# Altium schematic sheet AuxHalfH.SchDoc
size A3; DocumentNumber: 5; SheetNumber: 5; SheetTotal: 5
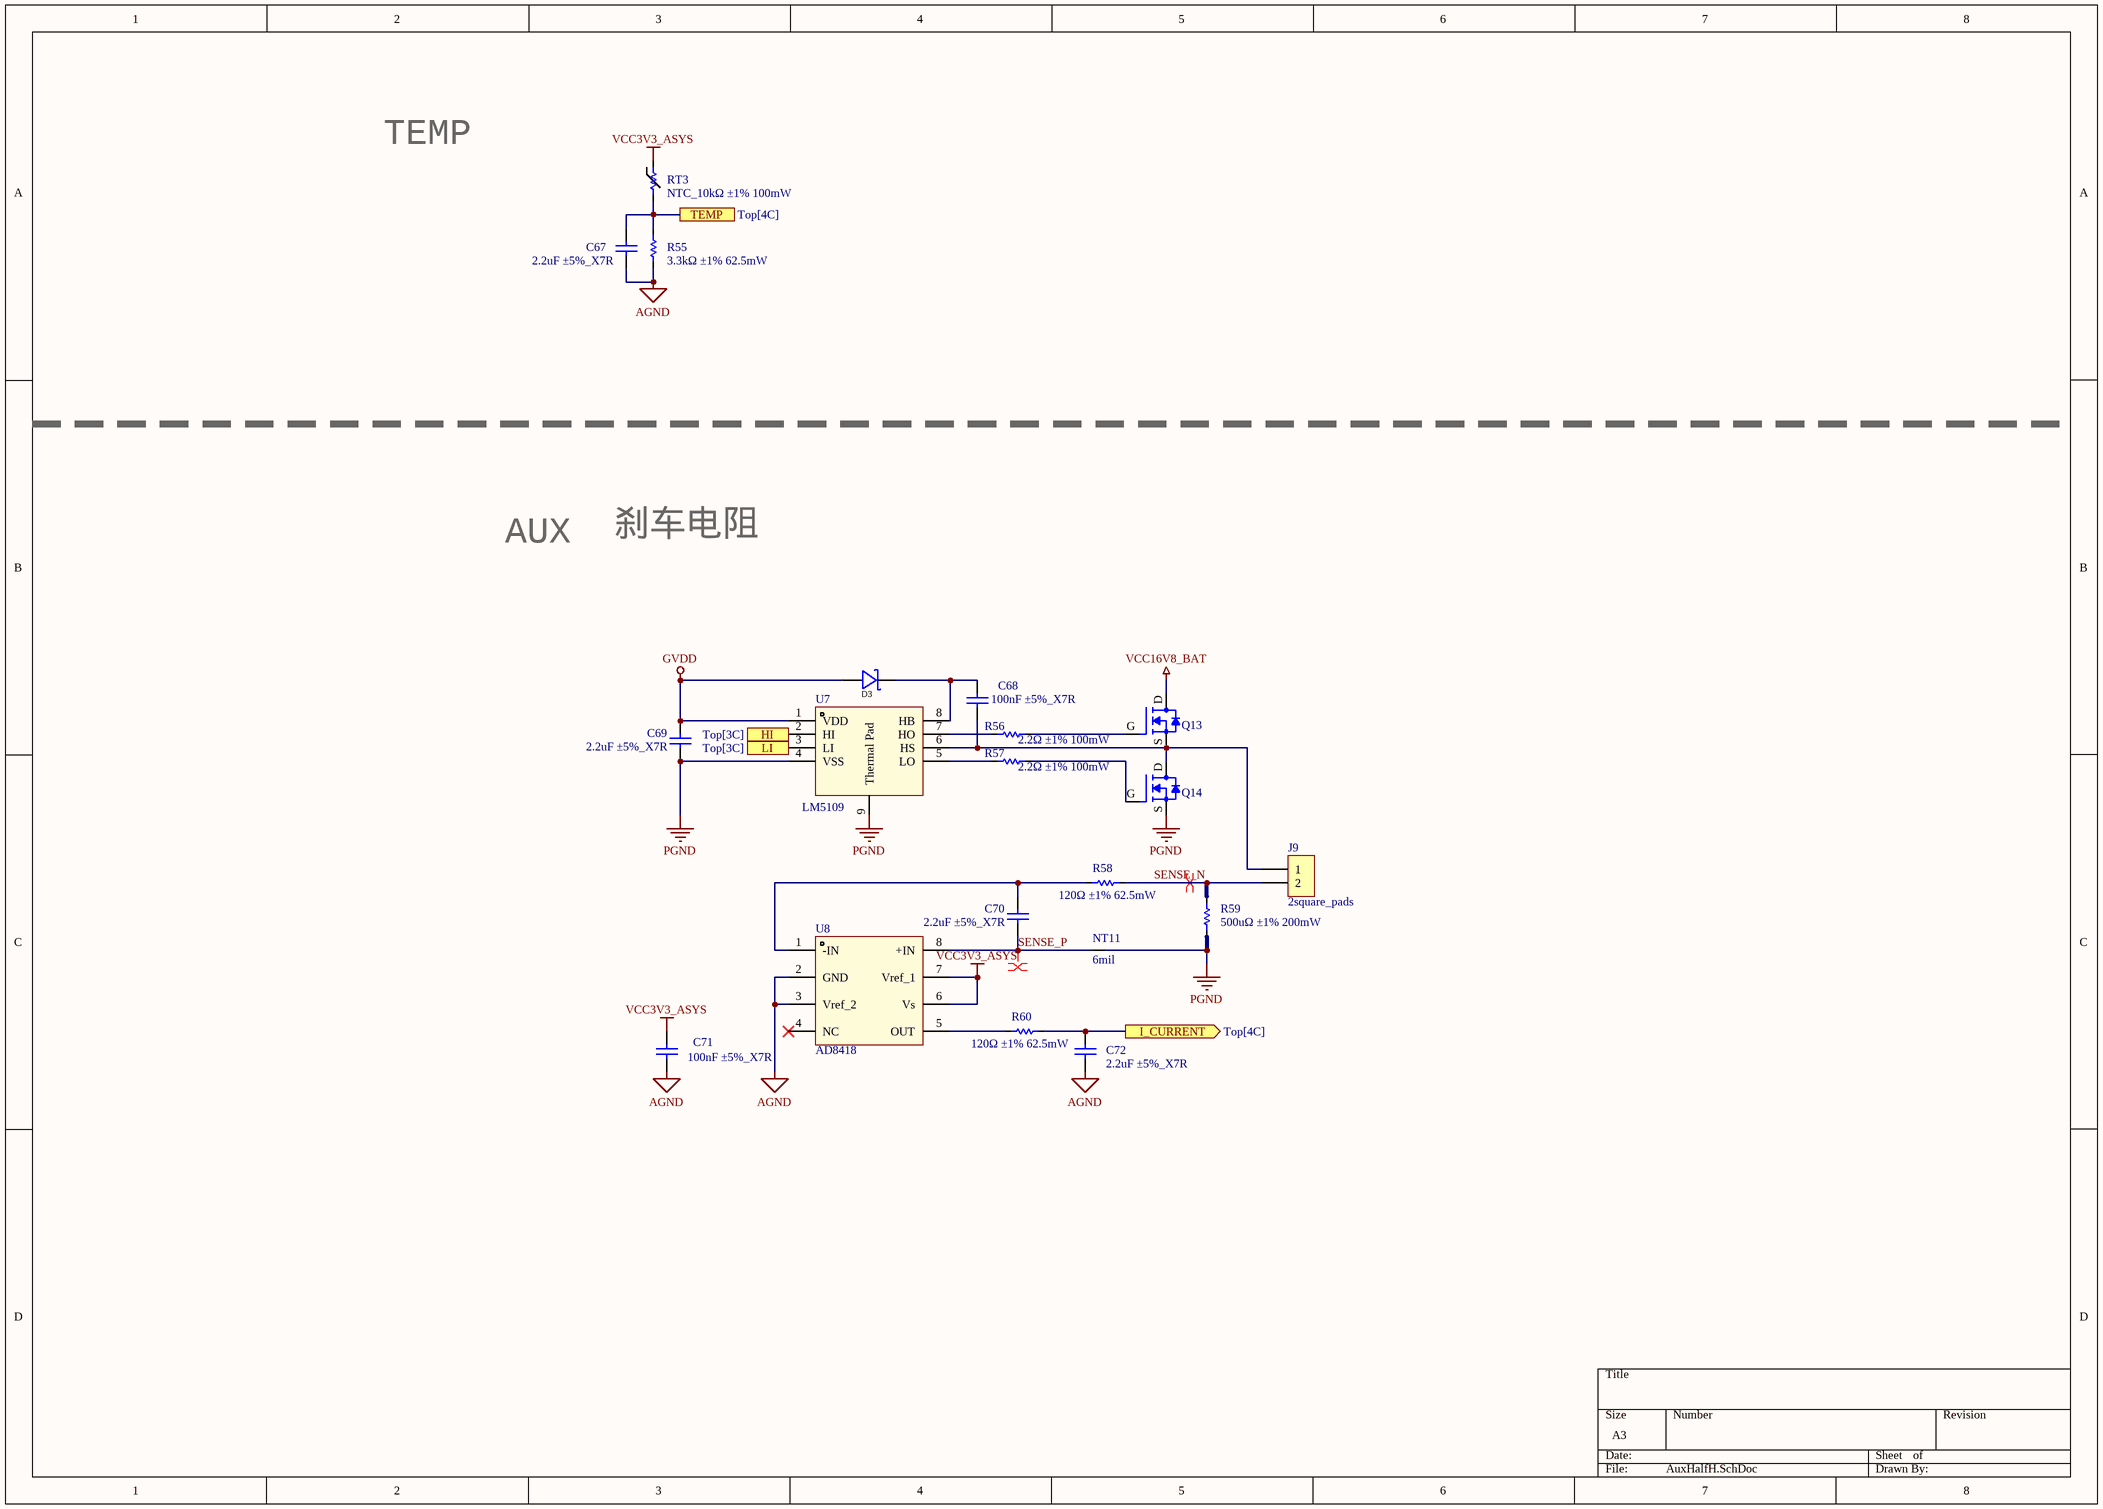
[diagram p0: AuxHalfH.SchDoc]

## Parts
C67  2.2uF ±5%_X7R  [WCAP-CSGP_0402_L1W0.5H0.5]
C68  100nF ±5%_X7R  [WCAP-CSGP_0603_L1.6W0.8H0.8_Reflow]
C69  2.2uF ±5%_X7R  [WCAP-CSGP_0603_L1.6W0.8H0.8_Reflow]
C70  2.2uF ±5%_X7R  [WCAP-CSGP_0402_L1W0.5H0.5]
C71  100nF ±5%_X7R  [WCAP-CSGP_0402_L1W0.5H0.5]
C72  2.2uF ±5%_X7R  [WCAP-CSGP_0402_L1W0.5H0.5]
D3  B340A-13-F  [SMA_L4.4-W2.6-LS5.0-RD]  (value not drawn)
J9  2square_pads  [2pads_square]
NT11  6mil  [NETTIE_6mil]  (net tie, no BOM)
Q13  BSC027N04LSG  [NRVTS10100EMFST1G]  (value not drawn)
Q14  BSC027N04LSG  [NRVTS10100EMFST1G]  (value not drawn)
R55  3.3kΩ ±1% 62.5mW  [WRIS-KSKE_0402]
R56  2.2Ω ±1% 100mW  [WRIS-KSKE_0402]
R57  2.2Ω ±1% 100mW  [WRIS-KSKE_0402]
R58  120Ω ±1% 62.5mW  [WRIS-KSKE_0402]
R59  500uΩ ±1% 200mW  [WRIS-KSKE_2512]
R60  120Ω ±1% 62.5mW  [WRIS-KSKE_0402]
RT3  NTC_10kΩ ±1% 100mW  [WRIS-KSKE_0402]
U7  LM5109  [SON80P400X80_HS-9N]
U8  AD8418  [MSOP-8_L3.0-W3.0-P0.65-LS5.0-BL]

## Ports
HI (see Top[3C]), I_CURRENT (out, see Top[4C]), LI (see Top[3C]), TEMP (see Top[4C])

## Nets
AGND: C67.1 C71.1 C72.1 R55.1 U8.2(GND) U8.3(Vref_2)
GVDD: C69.2 D3.2(A) U7.1(VDD)
PGND: C69.1 NT11.1 Q14.S R59.2 U7.4(VSS) U7.9(Thermal_Pad)
VCC3V3_ASYS: C71.2 RT3.1 U8.6(Vs) U8.7(Vref_1)
VCC16V8_BAT: Q13.D
HI: U7.2(HI) ; port HI
I_CURRENT: C72.2 R60.1 ; port I_CURRENT
LI: U7.3(LI) ; port LI
SENSE_N: J9.2 R58.1 R59.1
SENSE_P: C70.1 NT11.2 U8.8(+IN)
TEMP: C67.2 R55.2 RT3.2 ; port TEMP
NetC68_1: C68.1 J9.1 Q13.S Q14.D U7.6(HS)
NetC68_2: C68.2 D3.1(K) U7.8(HB)
NetC70_2: C70.2 R58.2 U8.1(-IN)
NetQ13_G: Q13.G R56.1
NetQ14_G: Q14.G R57.1
NetR56_2: R56.2 U7.7(HO)
NetR57_2: R57.2 U7.5(LO)
NetR60_2: R60.2 U8.5(OUT)

Not connected (* = marked no-connect by the designer): U8 4(NC)*

## Layout directives
differential pair: SENSE_N, SENSE_P

## Notes on the sheet
- TEMP
- AUX
- 刹车电阻

## Library data of the parts
C67-C72 = Cap: Capacitor; Published: 8-Jun-2000; LatestRevisionDate: 17-Jul-2002; LatestRevisionNote: Re-released for DXP Platform.; PackageReference: RAD-0.3; Publisher: Altium Limited; PackageDescription: Radial Cap, Thru-Hole; 2 Leads; 0.3 in Pin Spacing
D3 = Diode_Schottky: 直流反向耐压(Vr):40V;平均整流电流(Io):3A;正向压降(Vf):500mV@3A;; Manufacturer: DIODES(美台); Add into BOM: yes; Reverse Voltage (Vr): 40V; Average Rectified Current (Io): 3A; Name: B340A-13-F; Symbol: B340A-13-F; Device: B340A-13-F; LCSC Part Name: 40V 3A 500mV@3A; Supplier Part: C85098; Manufacturer Part: B340A-13-F; Supplier Footprint: SMA(DO-214AC); JLCPCB Part Class: 扩展库; Datasheet: https://atta.szlcsc.com/upload/public/pdf/source/20171023/C134454_15087453575121052549.pdf; Supplier: LCSC; Convert to PCB: yes; Forward Voltage (Vf@If): 500mV@3A
NT11 = NETTIE
Q13 Q14 = MOSFET-N: MOSFET – Power, Single, / N-Channel, PG-TDSON-8 / SuperSO8 5x6 / 40 V, 139 A; Manufacturer: ON Semiconductor; Manufacturer Part Number: NTMFS4935NT1G; Drain to Source Voltage (Vdss): 30V; Current - Continuous Drain (Id) @ 25°C: 13A (Ta), 93A (Tc); Drive Voltage (Max Rds On,  Min Rds On): 4.5V, 10V; Vgs(th) (Max) @ Id: 2.2V @ 250µA; Gate Charge (Qg) (Max) @ Vgs: 49.4nC @ 10V; Input Capacitance (Ciss) (Max) @ Vds: 4850pF @ 15V; Vgs (Max): ±20V; Power Dissipation (Max): 930mW (Ta), 48W (Tc); Rds On (Max) @ Id, Vgs: 3.2 mOhm @ 30A, 10V; Supplier 1: Digi-Key; Supplier Part Number 1: NTMFS4935NT1GOSCT-ND; RoHS: RoHS Compliant; Category: Discrete Semiconductor Products; Stock 1: 932; Pricing 1: 1=0.61, 10=0.541, 100=0.4145, 500=0.3277 (USD); Packaging: Cut Tape (CT); Part Status: Active; FET Type: N-Channel; Technology: MOSFET (Metal Oxide); FET Feature: -; Operating Temperature: -55°C ~ 150°C (TJ); Mounting Type: Surface Mount; Supplier Device Package: 5-DFN (5x6) (8-SOFL); Package / Case: 8-PowerTDFN, 5 Leads; ComponentLink1URL: http://www.onsemi.com/pub_link/Collateral/NTMFS4935N-D.PDF; ComponentLink1Description: http://www.onsemi.com/pub_link/Collateral/NTMFS4935N-D.PDF
R55-R60 = Res: Resistor; Published: 8-Jun-2000; LatestRevisionDate: 17-Jul-2002; LatestRevisionNote: Re-released for DXP Platform.; PackageReference: AXIAL-0.3; Publisher: Altium Limited; PackageDescription: Axial Device, Thru-Hole; 2 Leads; 0.3 in Pin Spacing
RT3 = TEMP RES: THERMISTOR 10K OHM NTC 0402 SMD
U7 = LM5109: DRIVER, MOSFET, HALF BRIDGE, WSON-8, 1A; Supplier 1: Farnell; Supplier Part Number 1: 2400642RL; Supplier 2: Farnell; Supplier Part Number 2: 2400642; Supplier 3: Farnell; Supplier Part Number 3: 2382850
U8 = AD8418WBRZ: ANALOG DEVICES Current Sense Amplifier, Bidirectional, 1, 130 µA, NSOIC